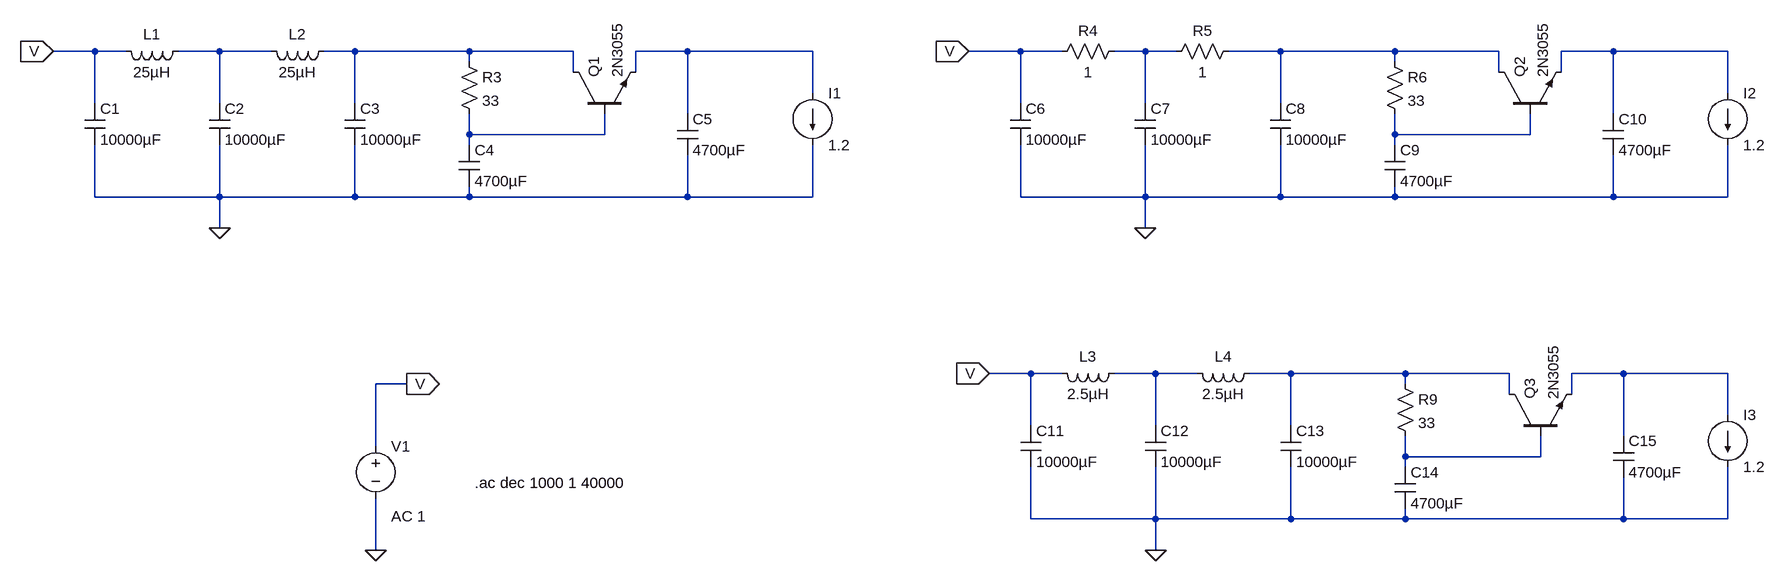
[diagram p0: schematic kondoheater.asc]
kondoheater.asc, the LTspice schematic file:
Version 4
SHEET 1 2784 824
WIRE 208 16 144 16
WIRE 256 16 208 16
WIRE 400 16 336 16
WIRE 480 16 400 16
WIRE 608 16 560 16
WIRE 784 16 608 16
WIRE 944 16 784 16
WIRE 1120 16 1040 16
WIRE 1312 16 1120 16
WIRE 1632 16 1552 16
WIRE 1696 16 1632 16
WIRE 1824 16 1776 16
WIRE 1872 16 1824 16
WIRE 2032 16 1952 16
WIRE 2208 16 2032 16
WIRE 2368 16 2208 16
WIRE 2544 16 2464 16
WIRE 2720 16 2544 16
WIRE 784 32 784 16
WIRE 2208 32 2208 16
WIRE 944 48 944 16
WIRE 1040 48 1040 16
WIRE 2368 48 2368 16
WIRE 2464 48 2464 16
WIRE 1312 80 1312 16
WIRE 2720 80 2720 16
WIRE 208 96 208 16
WIRE 400 96 400 16
WIRE 608 96 608 16
WIRE 1632 96 1632 16
WIRE 1824 96 1824 16
WIRE 2032 96 2032 16
WIRE 1120 112 1120 16
WIRE 2544 112 2544 16
WIRE 784 144 784 112
WIRE 992 144 992 112
WIRE 992 144 784 144
WIRE 2208 144 2208 112
WIRE 2416 144 2416 112
WIRE 2416 144 2208 144
WIRE 784 160 784 144
WIRE 2208 160 2208 144
WIRE 208 240 208 160
WIRE 400 240 400 160
WIRE 400 240 208 240
WIRE 608 240 608 160
WIRE 608 240 400 240
WIRE 784 240 784 224
WIRE 784 240 608 240
WIRE 1120 240 1120 176
WIRE 1120 240 784 240
WIRE 1312 240 1312 160
WIRE 1312 240 1120 240
WIRE 1632 240 1632 160
WIRE 1824 240 1824 160
WIRE 1824 240 1632 240
WIRE 2032 240 2032 160
WIRE 2032 240 1824 240
WIRE 2208 240 2208 224
WIRE 2208 240 2032 240
WIRE 2544 240 2544 176
WIRE 2544 240 2208 240
WIRE 2720 240 2720 160
WIRE 2720 240 2544 240
WIRE 400 288 400 240
WIRE 1824 288 1824 240
WIRE 1648 512 1584 512
WIRE 1696 512 1648 512
WIRE 1840 512 1776 512
WIRE 1904 512 1840 512
WIRE 2048 512 1984 512
WIRE 2224 512 2048 512
WIRE 2384 512 2224 512
WIRE 2560 512 2480 512
WIRE 2720 512 2560 512
WIRE 688 528 640 528
WIRE 2224 528 2224 512
WIRE 2384 544 2384 512
WIRE 2480 544 2480 512
WIRE 2720 576 2720 512
WIRE 1648 592 1648 512
WIRE 1840 592 1840 512
WIRE 2048 592 2048 512
WIRE 2560 608 2560 512
WIRE 640 624 640 528
WIRE 2224 640 2224 608
WIRE 2432 640 2432 608
WIRE 2432 640 2224 640
WIRE 2224 656 2224 640
WIRE 1648 736 1648 656
WIRE 1840 736 1840 656
WIRE 1840 736 1648 736
WIRE 2048 736 2048 656
WIRE 2048 736 1840 736
WIRE 2224 736 2224 720
WIRE 2224 736 2048 736
WIRE 2560 736 2560 672
WIRE 2560 736 2224 736
WIRE 2720 736 2720 656
WIRE 2720 736 2560 736
WIRE 640 784 640 704
WIRE 1840 784 1840 736
FLAG 640 784 0
FLAG 400 288 0
FLAG 1824 288 0
FLAG 1840 784 0
FLAG 688 528 V
IOPIN 688 528 Out
FLAG 1584 512 V
IOPIN 1584 512 In
FLAG 1552 16 V
IOPIN 1552 16 In
FLAG 144 16 V
IOPIN 144 16 In
SYMBOL voltage 640 608 R0
WINDOW 123 24 124 Left 2
WINDOW 39 0 0 Left 0
SYMATTR Value2 AC 1
SYMATTR InstName V1
SYMATTR Value ""
SYMBOL cap 192 96 R0
SYMATTR InstName C1
SYMATTR Value 10000µF
SYMATTR SpiceLine Rser=30mO
SYMBOL ind 352 0 R90
WINDOW 0 5 56 VBottom 2
WINDOW 3 32 56 VTop 2
SYMATTR InstName L1
SYMATTR Value 25µH
SYMATTR SpiceLine Rser=1
SYMBOL ind 576 0 R90
WINDOW 0 5 56 VBottom 2
WINDOW 3 32 56 VTop 2
SYMATTR InstName L2
SYMATTR Value 25µH
SYMATTR SpiceLine Rser=1
SYMBOL cap 384 96 R0
SYMATTR InstName C2
SYMATTR Value 10000µF
SYMATTR SpiceLine Rser=30mO
SYMBOL cap 592 96 R0
SYMATTR InstName C3
SYMATTR Value 10000µF
SYMATTR SpiceLine Rser=30mO
SYMBOL res 768 16 R0
SYMATTR InstName R3
SYMATTR Value 33
SYMBOL cap 768 160 R0
SYMATTR InstName C4
SYMATTR Value 4700µF
SYMATTR SpiceLine Rser=15m
SYMBOL npn 944 112 R270
SYMATTR InstName Q1
SYMATTR Value 2N3055
SYMBOL cap 1104 112 R0
SYMATTR InstName C5
SYMATTR Value 4700µF
SYMATTR SpiceLine Rser=30mO
SYMBOL cap 1616 96 R0
SYMATTR InstName C6
SYMATTR Value 10000µF
SYMATTR SpiceLine Rser=30mO
SYMBOL res 1792 0 R90
WINDOW 0 0 56 VBottom 2
WINDOW 3 32 56 VTop 2
SYMATTR InstName R4
SYMATTR Value 1
SYMBOL res 1968 0 R90
WINDOW 0 0 56 VBottom 2
WINDOW 3 32 56 VTop 2
SYMATTR InstName R5
SYMATTR Value 1
SYMBOL cap 1808 96 R0
SYMATTR InstName C7
SYMATTR Value 10000µF
SYMATTR SpiceLine Rser=30mO
SYMBOL cap 2016 96 R0
SYMATTR InstName C8
SYMATTR Value 10000µF
SYMATTR SpiceLine Rser=30mO
SYMBOL res 2192 16 R0
SYMATTR InstName R6
SYMATTR Value 33
SYMBOL cap 2192 160 R0
SYMATTR InstName C9
SYMATTR Value 4700µF
SYMATTR SpiceLine Rser=15mO
SYMBOL npn 2368 112 R270
SYMATTR InstName Q2
SYMATTR Value 2N3055
SYMBOL cap 2528 112 R0
SYMATTR InstName C10
SYMATTR Value 4700µF
SYMATTR SpiceLine Rser=30mO
SYMBOL cap 1632 592 R0
SYMATTR InstName C11
SYMATTR Value 10000µF
SYMATTR SpiceLine Rser=30mO
SYMBOL ind 1792 496 R90
WINDOW 0 5 56 VBottom 2
WINDOW 3 32 56 VTop 2
SYMATTR InstName L3
SYMATTR Value 2.5µH
SYMATTR SpiceLine Rser=1
SYMBOL ind 2000 496 R90
WINDOW 0 5 56 VBottom 2
WINDOW 3 32 56 VTop 2
SYMATTR InstName L4
SYMATTR Value 2.5µH
SYMATTR SpiceLine Rser=1
SYMBOL cap 1824 592 R0
SYMATTR InstName C12
SYMATTR Value 10000µF
SYMATTR SpiceLine Rser=30mO
SYMBOL cap 2032 592 R0
SYMATTR InstName C13
SYMATTR Value 10000µF
SYMATTR SpiceLine Rser=30mO
SYMBOL res 2208 512 R0
SYMATTR InstName R9
SYMATTR Value 33
SYMBOL cap 2208 656 R0
SYMATTR InstName C14
SYMATTR Value 4700µF
SYMATTR SpiceLine Rser=15mO
SYMBOL npn 2384 608 R270
SYMATTR InstName Q3
SYMATTR Value 2N3055
SYMBOL cap 2544 608 R0
SYMATTR InstName C15
SYMATTR Value 4700µF
SYMATTR SpiceLine Rser=30mO
SYMBOL load2 1312 80 R0
WINDOW 123 0 0 Left 0
WINDOW 39 0 0 Left 0
SYMATTR InstName I1
SYMATTR Value 1.2
SYMBOL load2 2720 80 R0
WINDOW 123 0 0 Left 0
WINDOW 39 0 0 Left 0
SYMATTR InstName I2
SYMATTR Value 1.2
SYMBOL load2 2720 576 R0
WINDOW 123 0 0 Left 0
WINDOW 39 0 0 Left 0
SYMATTR InstName I3
SYMATTR Value 1.2
TEXT 792 680 Left 2 !.ac dec 1000 1 40000

The netlist it stands for:
* kondoheater.asc
V1 V 0 AC 1
C1 V 0 10000µF Rser=30mO
L1 N001 V 25µH Rser=1
L2 N002 N001 25µH Rser=1
C2 N001 0 10000µF Rser=30mO
C3 N002 0 10000µF Rser=30mO
R3 N002 N007 33
C4 N007 0 4700µF Rser=15m
Q1 N002 N007 N003 0 2N3055
C5 N003 0 4700µF Rser=30mO
C6 V 0 10000µF Rser=30mO
R4 N004 V 1
R5 N005 N004 1
C7 N004 0 10000µF Rser=30mO
C8 N005 0 10000µF Rser=30mO
R6 N005 N008 33
C9 N008 0 4700µF Rser=15mO
Q2 N005 N008 N006 0 2N3055
C10 N006 0 4700µF Rser=30mO
C11 V 0 10000µF Rser=30mO
L3 N009 V 2.5µH Rser=1
L4 N010 N009 2.5µH Rser=1
C12 N009 0 10000µF Rser=30mO
C13 N010 0 10000µF Rser=30mO
R9 N010 N012 33
C14 N012 0 4700µF Rser=15mO
Q3 N010 N012 N011 0 2N3055
C15 N011 0 4700µF Rser=30mO
I1 N003 0 1.2
I2 N006 0 1.2
I3 N011 0 1.2
.model NPN NPN
.model PNP PNP
.lib standard.bjt
.ac dec 1000 1 40000
.backanno
.end